# Altium schematic sheet USB_RS485_Board.SchDoc: USB_RS485
size A3; Address1: TranMinhTri; Address2: Elec2PCB.com; Address3: Zalo 0839747278; SheetNumber: 1; SheetTotal: 1
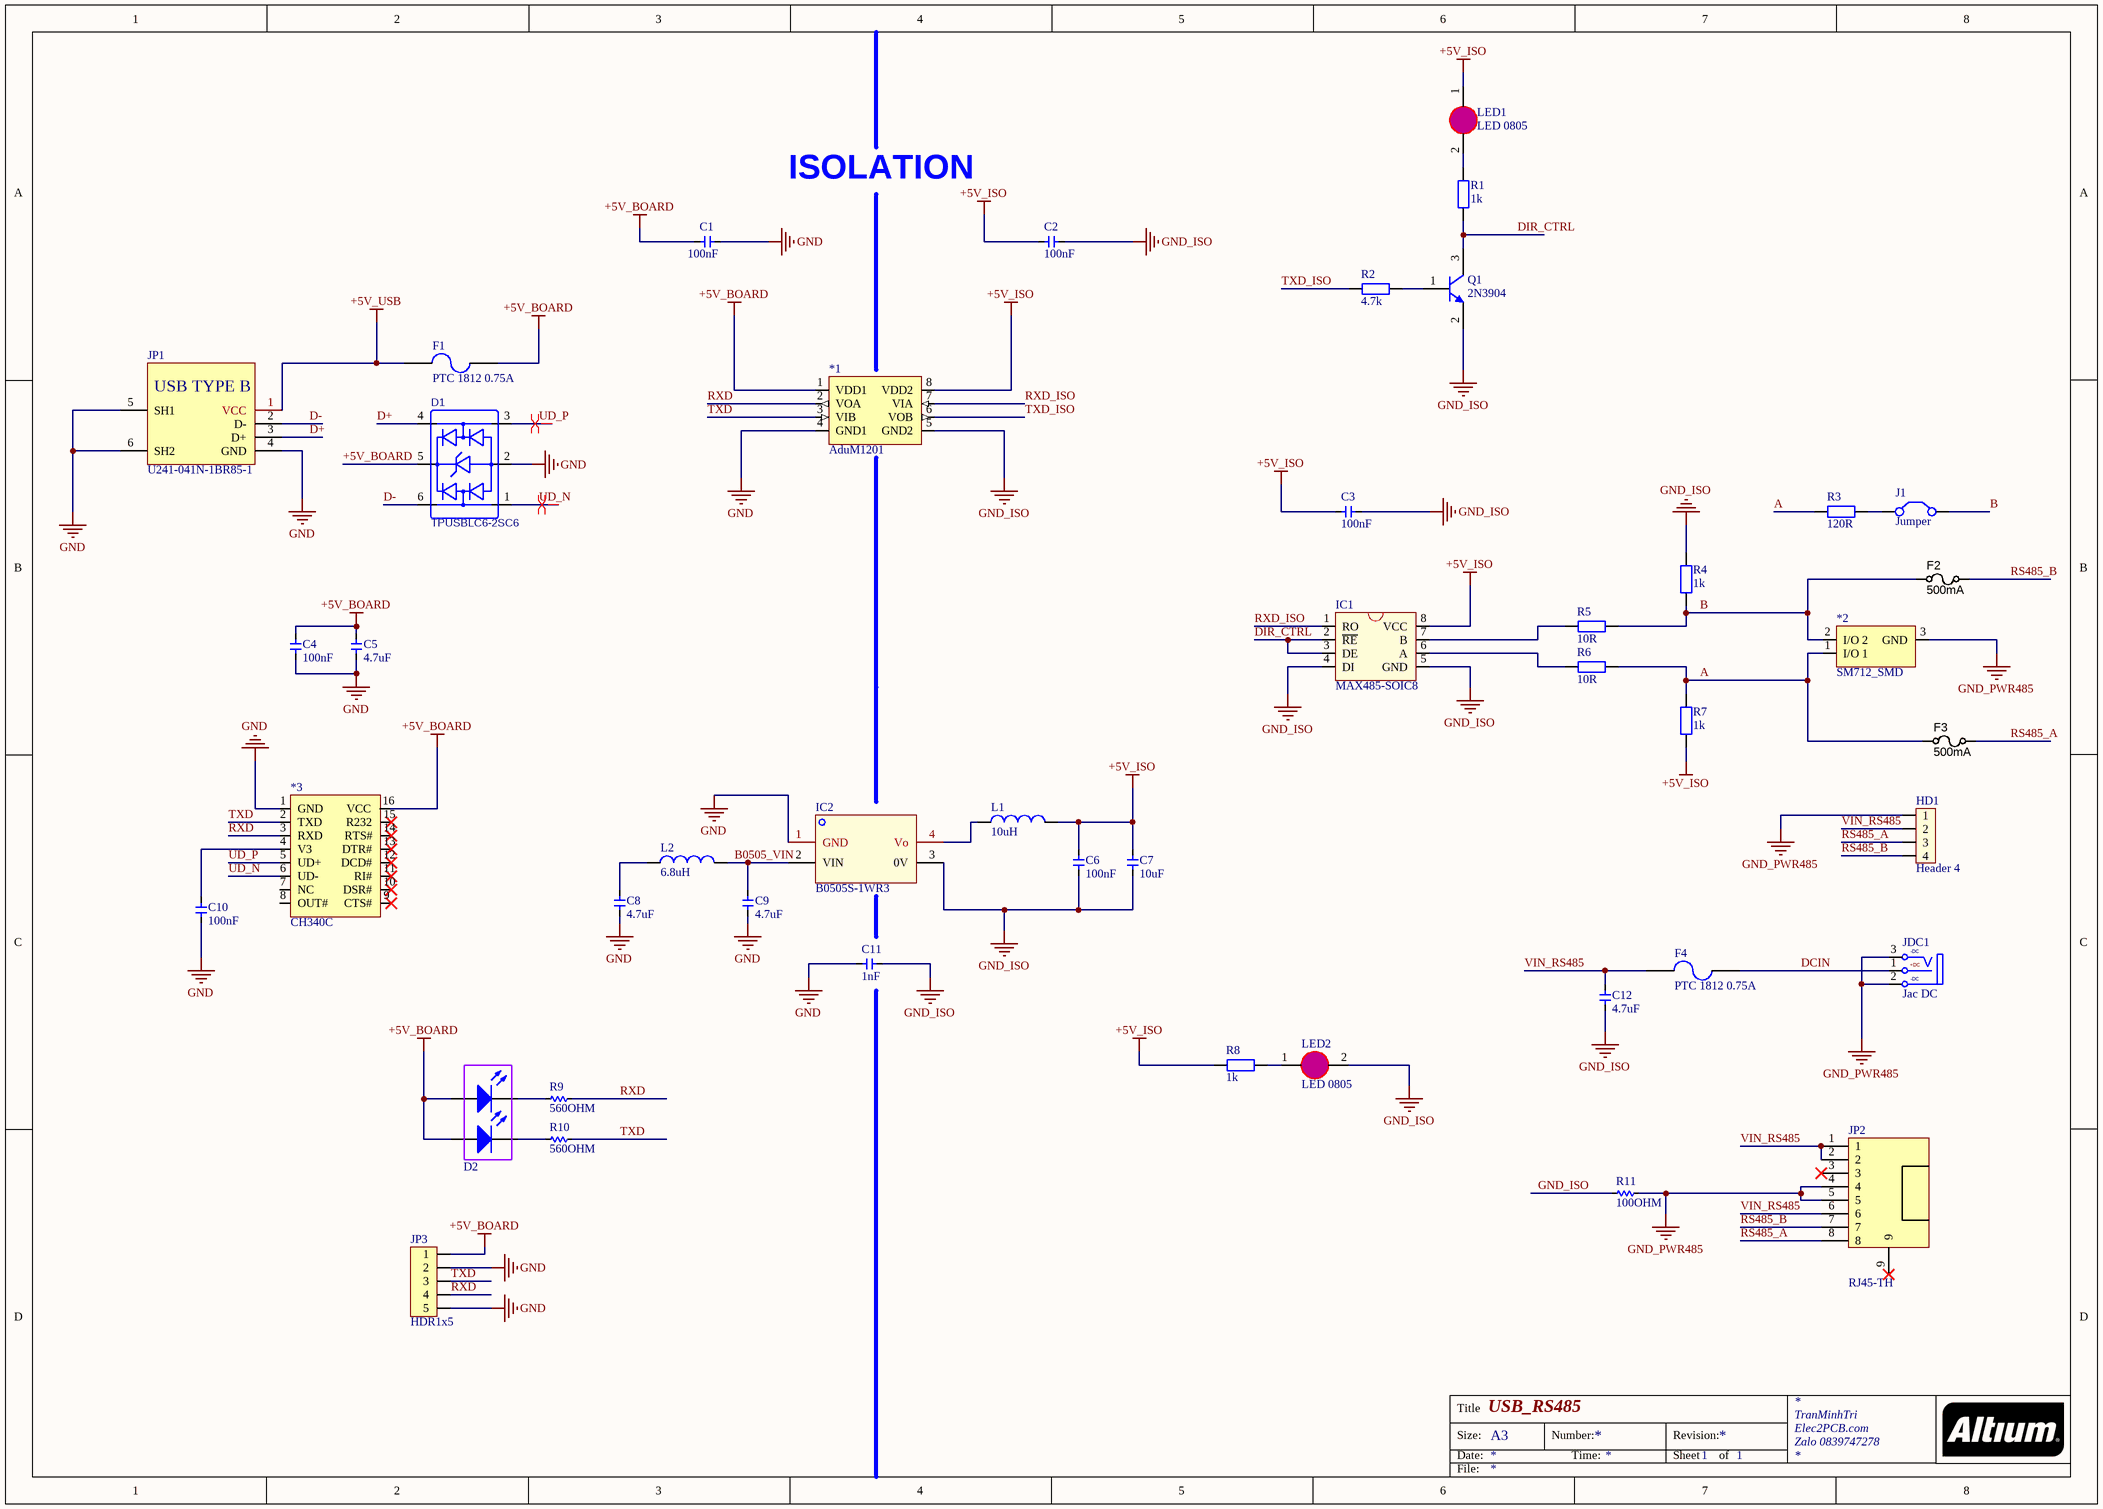
[diagram p0: USB_RS485_Board.SchDoc]

## Parts
*1  AduM1201  [SO-8]
*2  SM712_SMD  [SOT23-3]
*3  CH340C  [SOP16]
C1  100nF  [C_0603]
C2  100nF  [C_0603]
C3  100nF  [C_0603]
C4  100nF  [C_0603]
C5  4.7uF  [C_1206]
C6  100nF  [C_0603]
C7  10uF  [C_1206]
C8  4.7uF  [C_1206]
C9  4.7uF  [C_1206]
C10  100nF  [C_0603]
C11  1nF  [C_1206]
C12  4.7uF  [C_1206]
D1  TPUSBLC6-2SC6  [SOT-23-6_L2.9-W1.6-P0.95-LS2.8-BR]
D2  2LED_3MM  [2LED_3MM]  (value not drawn)
F1  PTC 1812 0.75A  [Fuse_1812_smd]
F2  value 500mA  [FUSE-SM-1206]  (hidden comment: Fast Acting)
F3  value 500mA  [FUSE-SM-1206]  (hidden comment: Fast Acting)
F4  PTC 1812 0.75A  [Fuse_1812_smd]
HD1  Header 4  [Terminal plug 3.81_4P]
IC1  MAX485-SOIC8  [SO-8]
IC2  B0505S-1WR3  [PWRM-TH_BXXXXS-1WR3]
J1  Jumper  [Header_2]
JDC1  Jac DC  [DC0]
JP1  U241-041N-1BR85-1  [USB-B-TH_U241-041N-1BR85-1]
JP2  RJ45-TH  [RJ45R10P-B000]
JP3  HDR1x5  [HDR1X5]  (no BOM)
L1  10uH  [IND-SMD_L4.0-W4.0]
L2  6.8uH  [IND-SMD_L4.0-W4.0]
LED1  LED 0805  [LED0805]
LED2  LED 0805  [LED0805]
Q1  2N3904  [17# 2SC1815-HF]
R1  1k  [R_0805]
R2  4.7k  [R_0805]
R3  120R  [R_1206]
R4  1k  [R_1206]
R5  10R  [tro smd 1206]
R6  10R  [tro smd 1206]
R7  1k  [tro smd 1206]
R8  1k  [R_0805]
R9  560OHM  [R_0805]
R10  560OHM  [R_0805]
R11  100OHM  [R_1206]

## Nets
+5V_BOARD: *1.1(VDD1) *3.16(VCC) C1.2 C4.2 C5.2 D1.5(VBUS) D2.1(A) D2.3(A) F1.2 JP3.1
+5V_ISO: *1.8(VDD2) C2.2 C3.2 C6.2 C7.2 IC1.8(VCC) L1.2 LED1.1(A) R7.1 R8.1
+5V_USB: F1.1 JP1.1(VCC)
GND: *1.4(GND1) *3.1(GND) C1.1 C4.1 C5.1 C8.1 C9.1 C10.1 C11.1 D1.2(GND) IC2.1(GND) JP1.4(GND) JP1.5(SH1) JP1.6(SH2) JP3.2 JP3.5
GND_ISO: *1.5(GND2) C2.1 C3.1 C6.1 C7.1 C11.2 C12.1 IC1.4(DI) IC1.5(GND) IC2.3(0V) LED2.2(K) Q1.2(E) R4.2 R11.2
GND_PWR485: *2.3(GND) HD1.1 JDC1.2(T) JDC1.3(TN) JP2.4 JP2.5 R11.1
A: *2.1(I/O_1) F3.1 R3.2 R6.2 R7.2
B: *2.2(I/O_2) F2.1 J1.2(C2) R4.1 R5.2
B0505_VIN: C9.2 IC2.2(VIN) L2.2
D+: D1.4(I/O2) JP1.3(D+)
D-: D1.6(I/O1) JP1.2(D-)
DCIN: F4.2 JDC1.1(S)
DIR_CTRL: IC1.2(~{RE}) IC1.3(DE) Q1.3(C) R1.1
RS485_A: F3.2 HD1.3 JP2.8
RS485_B: F2.2 HD1.4 JP2.7
RXD: *1.2(VOA) *3.3(RXD) JP3.4 R9.1
RXD_ISO: *1.7(VIA) IC1.1(RO)
TXD: *1.3(VIB) *3.2(TXD) JP3.3 R10.1
TXD_ISO: *1.6(VOB) R2.1
UD_N: *3.6(UD-) D1.1(I/O1)
UD_P: *3.5(UD+) D1.3(I/O2)
VIN_RS485: C12.2 F4.1 HD1.2 JP2.1 JP2.2 JP2.6
Net*3_4: *3.4(V3) C10.2
NetC8_2: C8.2 L2.1
NetD2_2: D2.2(K) R10.2
NetD2_4: D2.4(K) R9.2
NetIC1_6: IC1.6(A) R6.1
NetIC1_7: IC1.7(B) R5.1
NetIC2_4: IC2.4(Vo) L1.1
NetJ1_1: J1.1(C1) R3.1
NetLED1_2: LED1.2(K) R1.2
NetLED2_1: LED2.1(A) R8.2
NetQ1_1: Q1.1(B) R2.2

Not connected (* = marked no-connect by the designer): *3 7(NC) 8(OUT#) 9(CTS#)* 10(DSR#)* 11(RI#)* 12(DCD#)* 13(DTR#)* 14(RTS#)* 15(R232)*; JP2 3* 9*

## Layout directives
differential pair: UD_N, UD_P

## Notes on the sheet
- ISOLATION
- Title
- Size:
- Date:
- A3
- Number:
- Time:
- Revision:
- Sheet
- of
- File:
- (in symbol DCIN_1) -DC; +DC
- (in symbol USB_TYPE_B_U241) USB TYPE B

## Library data of the parts
*3 = CH340C dip
C1-C4 C10 = CC0603KRX7R9BB104: 100nF 50V X7R ±10% 0603 Multilayer Ceramic Capacitors MLCC - SMD/SMT ROHS; Manufacturer: YAGEO; SMT Assembly: Yes; Manufacturer Part Number: CC0603KRX7R9BB104; Package: 0603; LCSC Part Number: C14663
C5-C9 C12 = 1206B475K500NT: 4.7uF 50V X7R ±10% 1206 Multilayer Ceramic Capacitors MLCC - SMD/SMT ROHS; Manufacturer: FH(Guangdong Fenghua Advanced Tech); SMT Assembly: Yes; Manufacturer Part Number: 1206B475K500NT; Package: 1206; LCSC Part Number: C29823
C11 = CC1206JKNPOCBN102: 1nF ±5% 1kV NP0 1206 Multilayer Ceramic Capacitors MLCC - SMD/SMT RoHS; Manufacturer: YAGEO; SMT Assembly: Yes; Manufacturer Part Number: CC1206JKNPOCBN102; Package: 1206; LCSC Part Number: C113872; Digikey Part Number: *; ComponentLink1Description: Digikey Link; ComponentLink1URL: https://www.digikey.com/en/products/detail/yageo/CC0603KRX7R9BB104/2103082?s=N4IgTCBcDaIMwEYEFoFwCzuWZA5AIiALoC%2BQA; ComponentLink2Description: LCSC Link; ComponentLink2URL: https://jlcpcb.com/parts/componentSearch?searchTxt=10k%200603; Pricing 1: *
D1 = ESD_TPUSBLC6-2SC6: ESD ROHS SOT23-6 DIODES; Manufacturer: TECH PUBLIC; SMT Assembly: Yes; SMT Type: Extend; BOM_Assembly Type: smtWeld; BOM_Paste Type: expand; BOM_Supplier: LCSC; LCSC Part Number: C558442; Manufacturer Part Number: TPUSBLC6-2SC6; Package: SOT-23-6; spicePre: D; spiceSymbolName: TPUSBLC6-2SC6
D2 = 2LED3MM: LED DUAL RED/GREEN DIFFUSED T/H; Manufacturer: Lumex; Manufacturer Part Number: SSF-LXH240IGD; SMT Assembly: No; Package: Through Hole; LCSC Part Number: No; ComponentLink1URL: https://datasheet.ciiva.com/16387/lumex20ssf-lxh240igd-16387412.pdf?src-supplier=Future+Electronics; ComponentLink1Description: https://datasheet.ciiva.com/16387/lumex20ssf-lxh240igd-16387412.pdf?src-supplier=Future+Electronics; ComponentLink2URL: https://datasheet.ciiva.com/4673/ssf-lxh240igd-59870-4673513.pdf?src-supplier=Mouser; ComponentLink2Description: https://datasheet.ciiva.com/4673/ssf-lxh240igd-59870-4673513.pdf?src-supplier=Mouser; ComponentLink3URL: https://datasheet.ciiva.com/14605/70127278-14605558.pdf?src-supplier=Allied+Electronics; ComponentLink3Description: https://datasheet.ciiva.com/14605/70127278-14605558.pdf?src-supplier=Allied+Electronics; ComponentLink4URL: https://datasheet.ciiva.com/16840/70127280-16840571.pdf?src-supplier=Allied+Electronics; ComponentLink4Description: https://datasheet.ciiva.com/16840/70127280-16840571.pdf?src-supplier=Allied+Electronics; ComponentLink5URL: https://datasheet.ciiva.com/1535/ssf-lxh240igd-1535964.pdf?src-supplier=Element14; ComponentLink5Description: https://datasheet.ciiva.com/1535/ssf-lxh240igd-1535964.pdf?src-supplier=Element14; ComponentLink6URL: https://datasheet.ciiva.com/1644/ssf-lxh240igd-1644716.pdf?src-supplier=Farnell; ComponentLink6Description: https://datasheet.ciiva.com/1644/ssf-lxh240igd-1644716.pdf?src-supplier=Farnell; ComponentLink7URL: https://datasheet.ciiva.com/1536/ssf-lxh240igd-1536046.pdf?src-supplier=Element14; ComponentLink7Description: https://datasheet.ciiva.com/1536/ssf-lxh240igd-1536046.pdf?src-supplier=Element14; ComponentLink8URL: https://datasheet.ciiva.com/1746/ssf-lxh240igd-1746846.pdf?src-supplier=Newark; ComponentLink8Description: https://datasheet.ciiva.com/1746/ssf-lxh240igd-1746846.pdf?src-supplier=Newark; ComponentLink9URL: http://datasheet.octopart.com/SSF-LXH240IGD-Lumex-datasheet-60839.pdf?src-supplier=Element14; ComponentLink9Description: http://datasheet.octopart.com/SSF-LXH240IGD-Lumex-datasheet-60839.pdf?src-supplier=Element14; ComponentLink10URL: http://datasheet.octopart.com/SSF-LXH240IGD-Lumex-datasheet-9743625.pdf?src-supplier=Allied+Electronics; ComponentLink10Description: http://datasheet.octopart.com/SSF-LXH240IGD-Lumex-datasheet-9743625.pdf?src-supplier=Allied+Electronics
F1 F4 = Fuse_PTC_mSMD075-33V: 1812 PTC RESETTABLE FUSES ROHS 24V; Manufacturer: TECHFUSE; SMT Assembly: Yes; Manufacturer Part Number: mSMD075-33V; Package: 1812; LCSC Part Number: C70117; Digikey Part Number: *; Manual Assembly: *; Pricing 1: 1=0.08630,10=0.04930 (LCSC)
F2 F3 = FUSE_FAST_500mA_0603: Fuse 500mA 32VDC 0603 SMD; Manufacturer 1: AVX Corporation; Manufacturer Part Number 1: F0603E0R50FSTR; Ratings: 500mA; 32VDC; fast acting; DC Cold Resistance: 0.25 Ohm; SCDType: source; Package / Case: 0603 (1608 metric); Fuse Type: Fast Acting; ComponentLink1URL: http://www.avx.com/docs/Catalogs/accug2.pdf; ComponentLink1Description: http://www.avx.com/docs/Catalogs/accug2.pdf; Supplier 1: Digi-Key; Supplier Part Number 1: 478-2860-1-ND; Operating Temperature: -55°C ~ 125°C
HD1 = Header4: Value: Header 4
IC1 = MAX485_1
IC2 = B0505S-1WR3: B0505S-1WR3 5V 200mA 5.5V 1 Plugin Power Modules ROHS; Manufacturer: MORNSUN Guangzhou S& T; SMT Assembly: No; Manual Assembly: Yes; Manufacturer Part Number: B0505S-1WR3; LCSC Part Number: C131038; Package: SIP-4; Digikey Part Number: 2725-B0505S-1WR3-ND; Manufacturer 2: Mornsun America, LLC; Manufacturer Part Number 2: B0505S-1WR3
J1 = Jumper: Jumper Wire; Published: 24-Mar-1999; LatestRevisionDate: 17-Jul-2002; LatestRevisionNote: Re-released for DXP Platform.; PackageReference: RAD-0.2; Publisher: Altium Limited; PackageDescription: Radial Cap, Thru-Hole; 2 Leads; 0.2 in Pin Spacing
JDC1 = DCIN_1: Jac DC input 5.5x2.1MM; Manufacturer Part Number: DC+02I; Manufacturer: JINJIA; SMT Assembly: No; LCSC Part Number: C718033; Package: Through Hole
JP1 = USB_TYPE_B_U241: USB - Type B Female USB 2.0 4 Through Hole USB Connectors RoHS; Manufacturer: XKB Connectivity; SMT Assembly: No; Manufacturer Part Number: U241-041N-1BR85-1; LCSC Part Number: C397338; Package: Through Hole
JP2 = RJ45R10P-B000: RJ45 18MM, No Transformer; Manufacturer: Ckmtw(Shenzhen Cankemeng); Manufacturer Part Number: R-RJ45R10P-B000; SMT Assembly: No; LCSC Part Number: C386758; Package: RJ45-TH_R-RJ45R10P-B000
JP3 = Header5: Header IDC, 5 x 1 Pin Vertical 2.54mm Pitch (Non-Boxed, Male); Manufacturer: No; SMT Assembly: No; ComponentLink1 Description: Manufacturer; ComponentLink2 Description: Datasheet; LCSC Part Number: No; ComponentLink1URL: http://www.we-online.com; ComponentLink2URL: http://katalog.we-online.de/em/datasheet/6130xx143121.pdf; Package: Through hole; Manufacturer Part Number: No
L1 L2 = IND_SWP_6R8: 6.8UH ±20% 980MA 247MΩ SMD,3.0X3.0X1.2MM POWER INDUCTORS ROHS; Manufacturer: Sunlord; Manufacturer Part Number: SWPA3012S6R8MT; SMT Assembly: Yes; LCSC Part Number: C83416; Package: SMD,3.0x3.0x1.2mm
LED1 LED2 = LEDSMD: Dán; Don_Vi: Con; Ten_Linh_Kien: *; Ma_Hang: *; Ghi_Chu: *; Kieu_Chan: *; Chung_Loai: Dán
Q1 = 17#2SC1815-SOT23 SMD: 2SC1815 50V 150mA / NPN SMD Transistor (No Pb, GP- Green Part) / SOT-23 Package; ComponentLink1Description: tme.vn; ComponentLink1URL: http://www.tme.vn/Product.aspx?id=413#page=pro_info
R1 R2 R8 = Tro 0603 1% 1k: Dán; So_Chan: 2; Don_Vi: Con; Ten_Linh_Kien: Trở 0603 1% 1k; Ma_Hang: MH006334; Chung_Loai: Dán; Kieu_Chan: *
R3 = Tro 0805 5% 120R: Dán; Don_Vi: Con; So_Chan: 2; Ten_Linh_Kien: Trở 0805 5% 120R; Ma_Hang: MH005253; Chung_Loai: Dán; Kieu_Chan: *
R4 = Tro 0805 5% 1k: Dán; Don_Vi: Con; So_Chan: 2; Ten_Linh_Kien: Trở 0805 5% 1k; Ma_Hang: MH005234; Chung_Loai: Dán; Kieu_Chan: *
R5-R7 = Tro 1206 5% 10R: Dán; Don_Vi: Con; So_Chan: 2; Ten_Linh_Kien: Trở 1206 5% 10R; Ma_Hang: MH005910; Chung_Loai: Dán; Kieu_Chan: *
R9 R10 = 0603WAF5600T5E: 560OHMS ±1% 1/10W 0603 ROHS; Manufacturer: Uniroyal Elec; SMT Assembly: Yes; ComponentLink1URL: https://datasheet.ciiva.com/7746/443971-7746518.pdf?src-supplier=Element14; ComponentLink1Description: https://datasheet.ciiva.com/7746/443971-7746518.pdf?src-supplier=Element14; ComponentLink2URL: https://datasheet.ciiva.com/2452/pyu-r-int-thick-7-2452887.pdf?src-supplier=Digi-Key; ComponentLink2Description: https://datasheet.ciiva.com/2452/pyu-r-int-thick-7-2452887.pdf?src-supplier=Digi-Key; ComponentLink3URL: https://datasheet.ciiva.com/12558/rc0603-272842-12558414.pdf?src-supplier=Mouser; ComponentLink3Description: https://datasheet.ciiva.com/12558/rc0603-272842-12558414.pdf?src-supplier=Mouser; ComponentLink4URL: https://datasheet.ciiva.com/7746/443971-7746517.pdf?src-supplier=Element14; ComponentLink4Description: https://datasheet.ciiva.com/7746/443971-7746517.pdf?src-supplier=Element14; ComponentLink5URL: https://datasheet.ciiva.com/2452/pyu-r-int-thick-7-2452888.pdf?src-supplier=Digi-Key; ComponentLink5Description: https://datasheet.ciiva.com/2452/pyu-r-int-thick-7-2452888.pdf?src-supplier=Digi-Key; ComponentLink6URL: https://datasheet.ciiva.com/2452/pyu-r-int-thick-7-2452889.pdf?src-supplier=Digi-Key; ComponentLink6Description: https://datasheet.ciiva.com/2452/pyu-r-int-thick-7-2452889.pdf?src-supplier=Digi-Key; Manufacturer Part Number: 0603WAF5600T5E; LCSC Part Number: C23204; Package: 0603
R11 = 0805W8F1000T5E: 100OHMS ±1% 1/8W 0805 ROHS; Manufacturer: Uniroyal Elec; SMT Assembly: Yes; Manufacturer Part Number: 0805W8F1000T5E; LCSC Part Number: C17408; Package: 0805; Digikey Part Number: *; Pricing 1: *